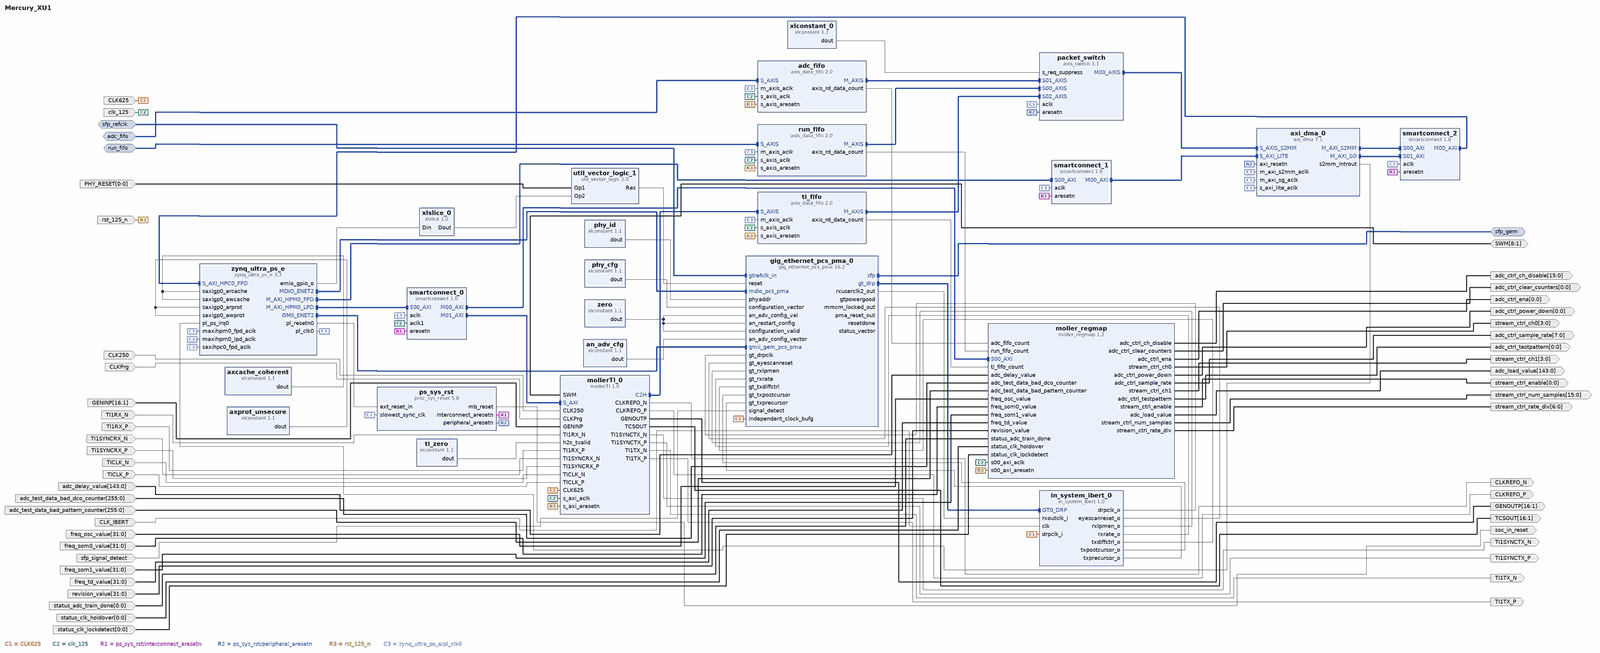
[diagram p0: block diagram of the top level, whole]
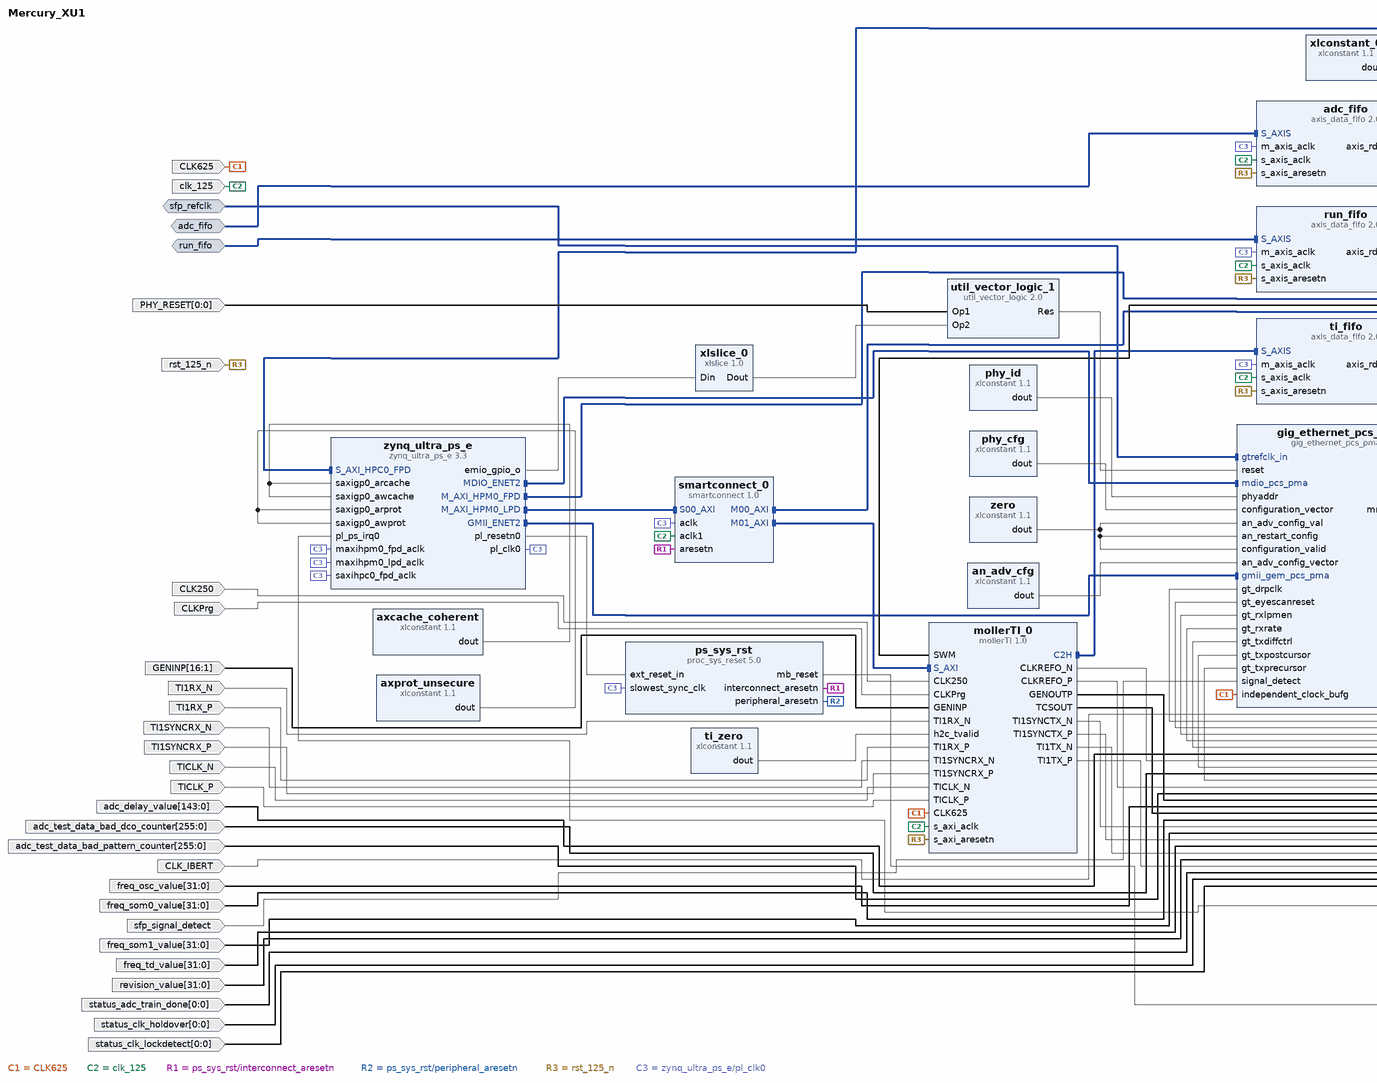
[diagram p1: block diagram of the top level, left part]
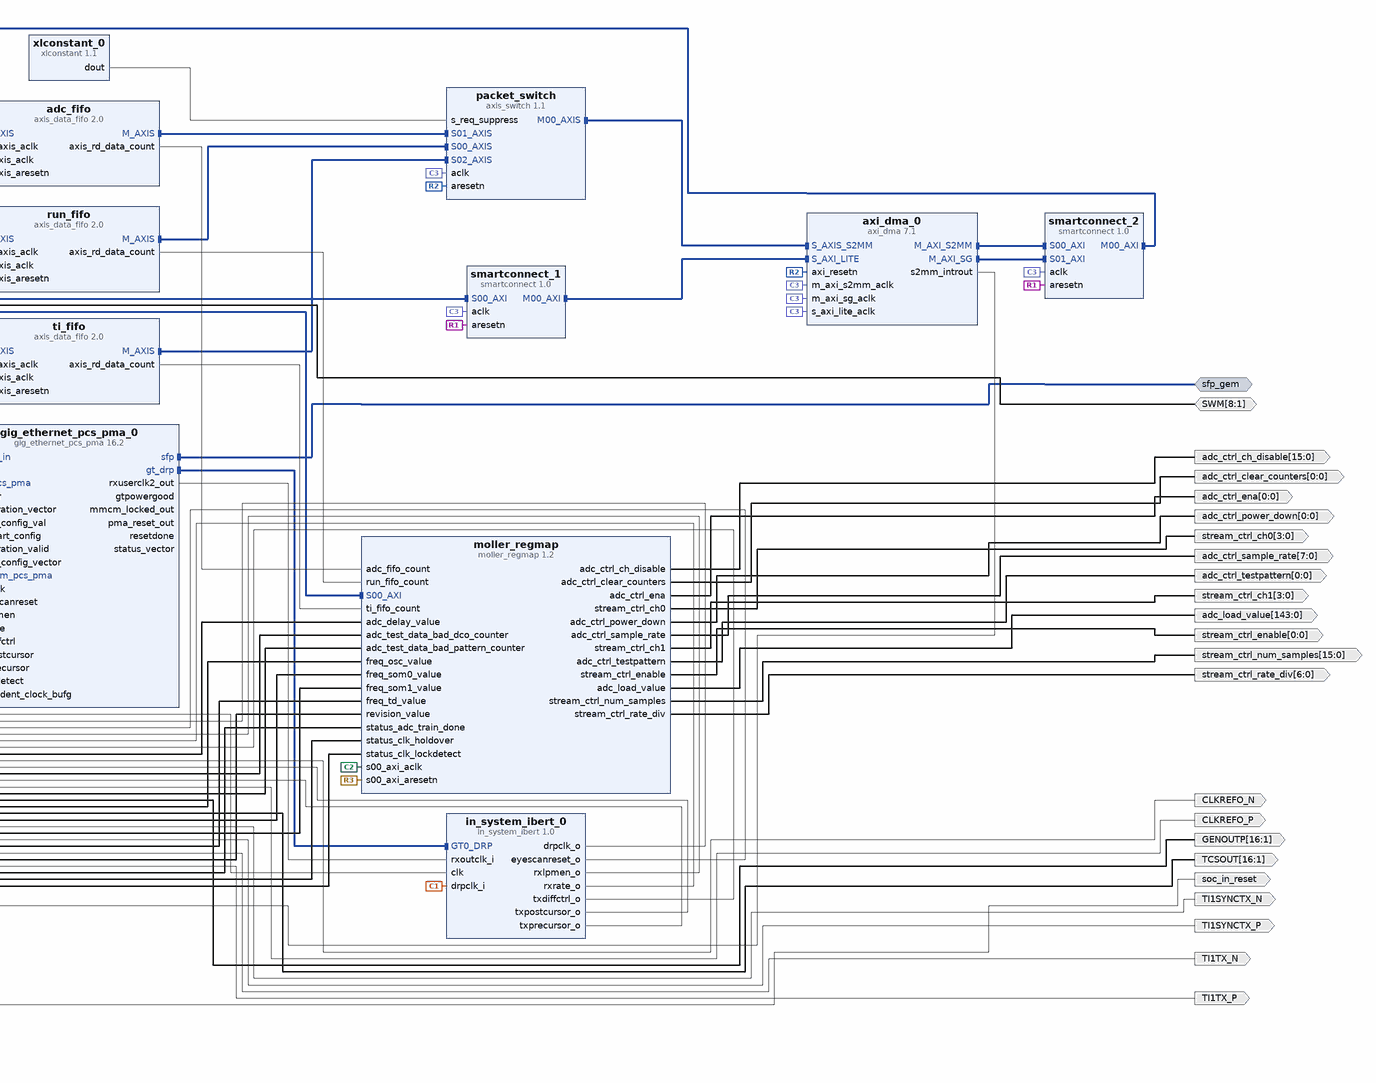
[diagram p2: block diagram of the top level, right part]
# Vivado block design Mercury_XU1, xczu6cg-ffvc900-1-e, Vivado 2020.2
create_bd_design Mercury_XU1

create_bd_intf_port -mode Slave -vlnv xilinx.com:interface:axis_rtl:1.0 adc_fifo
set_property -dict [list \
  CONFIG.FREQ_HZ 125000000 \
  CONFIG.HAS_TKEEP 0 \
  CONFIG.HAS_TLAST 1 \
  CONFIG.HAS_TREADY 1 \
  CONFIG.HAS_TSTRB 0 \
  CONFIG.LAYERED_METADATA undef \
  CONFIG.TDATA_NUM_BYTES 8 \
  CONFIG.TDEST_WIDTH 0 \
  CONFIG.TID_WIDTH 0 \
  CONFIG.TUSER_WIDTH 0 \
] [get_bd_intf_ports adc_fifo]
create_bd_intf_port -mode Slave -vlnv xilinx.com:interface:axis_rtl:1.0 run_fifo
set_property -dict [list \
  CONFIG.FREQ_HZ 125000000 \
  CONFIG.HAS_TKEEP 0 \
  CONFIG.HAS_TLAST 1 \
  CONFIG.HAS_TREADY 1 \
  CONFIG.HAS_TSTRB 0 \
  CONFIG.LAYERED_METADATA undef \
  CONFIG.TDATA_NUM_BYTES 8 \
  CONFIG.TDEST_WIDTH 0 \
  CONFIG.TID_WIDTH 0 \
  CONFIG.TUSER_WIDTH 0 \
] [get_bd_intf_ports run_fifo]
create_bd_intf_port -mode Slave -vlnv xilinx.com:interface:diff_clock_rtl:1.0 sfp_refclk
set_property -dict {CONFIG.FREQ_HZ 125000000} [get_bd_intf_ports sfp_refclk]
create_bd_intf_port -mode Master -vlnv xilinx.com:interface:sfp_rtl:1.0 sfp_gem
create_bd_port -dir I CLK250
create_bd_port -dir I CLK625
create_bd_port -dir I CLKPrg
create_bd_port -dir O CLKREFO_N
create_bd_port -dir O CLKREFO_P
create_bd_port -dir I -type clk CLK_IBERT
set_property -dict {CONFIG.FREQ_HZ 100000000} [get_bd_ports CLK_IBERT]
create_bd_port -dir I -from 16 -to 1 GENINP
create_bd_port -dir O -from 16 -to 1 GENOUTP
create_bd_port -dir I -from 0 -to 0 PHY_RESET
create_bd_port -dir IO -from 8 -to 1 SWM
create_bd_port -dir O -from 16 -to 1 TCSOUT
create_bd_port -dir I TI1RX_N
create_bd_port -dir I TI1RX_P
create_bd_port -dir I TI1SYNCRX_N
create_bd_port -dir I TI1SYNCRX_P
create_bd_port -dir O TI1SYNCTX_N
create_bd_port -dir O TI1SYNCTX_P
create_bd_port -dir O TI1TX_N
create_bd_port -dir O TI1TX_P
create_bd_port -dir I TICLK_N
create_bd_port -dir I TICLK_P
create_bd_port -dir O -from 15 -to 0 adc_ctrl_ch_disable
create_bd_port -dir O -from 0 -to 0 adc_ctrl_clear_counters
create_bd_port -dir O -from 0 -to 0 adc_ctrl_ena
create_bd_port -dir O -from 0 -to 0 adc_ctrl_power_down
create_bd_port -dir O -from 7 -to 0 adc_ctrl_sample_rate
create_bd_port -dir O -from 0 -to 0 adc_ctrl_testpattern
create_bd_port -dir I -from 143 -to 0 adc_delay_value
create_bd_port -dir O -from 143 -to 0 adc_load_value
create_bd_port -dir I -from 255 -to 0 adc_test_data_bad_dco_counter
create_bd_port -dir I -from 255 -to 0 adc_test_data_bad_pattern_counter
create_bd_port -dir I -type clk clk_125
set_property -dict [list \
  CONFIG.ASSOCIATED_BUSIF run_fifo:adc_fifo \
  CONFIG.ASSOCIATED_RESET rst_125_n:soc_in_reset:SYNC_RESET_0 \
  CONFIG.FREQ_HZ 125000000 \
] [get_bd_ports clk_125]
create_bd_port -dir I -from 31 -to 0 freq_osc_value
create_bd_port -dir I -from 31 -to 0 freq_som0_value
create_bd_port -dir I -from 31 -to 0 freq_som1_value
create_bd_port -dir I -from 31 -to 0 freq_td_value
create_bd_port -dir I -from 31 -to 0 revision_value
create_bd_port -dir I -type rst rst_125_n
set_property -dict {CONFIG.POLARITY ACTIVE_LOW} [get_bd_ports rst_125_n]
create_bd_port -dir I sfp_signal_detect
create_bd_port -dir O -type rst soc_in_reset
create_bd_port -dir I -from 0 -to 0 status_adc_train_done
create_bd_port -dir I -from 0 -to 0 status_clk_holdover
create_bd_port -dir I -from 0 -to 0 status_clk_lockdetect
create_bd_port -dir O -from 3 -to 0 stream_ctrl_ch0
create_bd_port -dir O -from 3 -to 0 stream_ctrl_ch1
create_bd_port -dir O -from 0 -to 0 stream_ctrl_enable
create_bd_port -dir O -from 15 -to 0 stream_ctrl_num_samples
create_bd_port -dir O -from 6 -to 0 stream_ctrl_rate_div

create_bd_cell -type ip -vlnv xilinx.com:ip:axis_data_fifo:2.0 adc_fifo
set_property -dict [list \
  CONFIG.FIFO_DEPTH 8192 \
  CONFIG.FIFO_MODE 2 \
  CONFIG.HAS_PROG_FULL 0 \
  CONFIG.HAS_RD_DATA_COUNT 1 \
  CONFIG.HAS_WR_DATA_COUNT 0 \
  CONFIG.IS_ACLK_ASYNC 1 \
  CONFIG.TDATA_NUM_BYTES 8 \
] [get_bd_cells adc_fifo]
create_bd_cell -type ip -vlnv xilinx.com:ip:xlconstant:1.1 an_adv_cfg
set_property -dict {CONFIG.CONST_VAL 32 CONFIG.CONST_WIDTH 16} [get_bd_cells an_adv_cfg]
create_bd_cell -type ip -vlnv xilinx.com:ip:xlconstant:1.1 axcache_coherent
set_property -dict {CONFIG.CONST_VAL 11 CONFIG.CONST_WIDTH 4} [get_bd_cells axcache_coherent]
create_bd_cell -type ip -vlnv xilinx.com:ip:axi_dma:7.1 axi_dma_0
set_property -dict [list \
  CONFIG.c_addr_width 48 \
  CONFIG.c_enable_multi_channel 0 \
  CONFIG.c_include_mm2s 0 \
  CONFIG.c_include_s2mm_dre 0 \
  CONFIG.c_s2mm_burst_size 256 \
  CONFIG.c_sg_include_stscntrl_strm 0 \
  CONFIG.c_sg_length_width 26 \
] [get_bd_cells axi_dma_0]
create_bd_cell -type ip -vlnv xilinx.com:ip:xlconstant:1.1 axprot_unsecure
set_property -dict {CONFIG.CONST_VAL 2 CONFIG.CONST_WIDTH 3} [get_bd_cells axprot_unsecure]
create_bd_cell -type ip -vlnv xilinx.com:ip:gig_ethernet_pcs_pma:16.2 gig_ethernet_pcs_pma_0
set_property -dict [list \
  CONFIG.Auto_Negotiation true \
  CONFIG.DrpClkRate 62.5 \
  CONFIG.EMAC_IF_TEMAC GEM \
  CONFIG.Ext_Management_Interface false \
  CONFIG.GT_Location X1Y4 \
  CONFIG.GTinEx false \
  CONFIG.RefClkRate 156.25 \
  CONFIG.RxGmiiClkSrc TXOUTCLK \
  CONFIG.SGMII_PHY_Mode true \
  CONFIG.Standard 1000BASEX \
  CONFIG.SupportLevel Include_Shared_Logic_in_Core \
  CONFIG.TransceiverControl true \
] [get_bd_cells gig_ethernet_pcs_pma_0]
create_bd_cell -type ip -vlnv xilinx.com:ip:in_system_ibert:1.0 in_system_ibert_0
set_property -dict {CONFIG.C_ENABLE_INPUT_PORTS true CONFIG.C_GTS_USED { X1Y4}} [get_bd_cells in_system_ibert_0]
create_bd_cell -type ip -vlnv TRIUMF:user:moller_regmap:1.2 moller_regmap
create_bd_cell -type ip -vlnv xilinx.com:ip:axis_switch:1.1 packet_switch
set_property -dict [list \
  CONFIG.ARB_ALGORITHM 0 \
  CONFIG.ARB_ON_MAX_XFERS 0 \
  CONFIG.ARB_ON_NUM_CYCLES 0 \
  CONFIG.ARB_ON_TLAST 1 \
  CONFIG.HAS_TLAST 1 \
  CONFIG.NUM_SI 3 \
  CONFIG.ROUTING_MODE 0 \
  CONFIG.TDATA_NUM_BYTES 8 \
] [get_bd_cells packet_switch]
create_bd_cell -type ip -vlnv xilinx.com:ip:xlconstant:1.1 phy_cfg
set_property -dict {CONFIG.CONST_VAL 0x0 CONFIG.CONST_WIDTH 5} [get_bd_cells phy_cfg]
create_bd_cell -type ip -vlnv xilinx.com:ip:xlconstant:1.1 phy_id
set_property -dict {CONFIG.CONST_VAL 9 CONFIG.CONST_WIDTH 5} [get_bd_cells phy_id]
create_bd_cell -type ip -vlnv xilinx.com:ip:proc_sys_reset:5.0 ps_sys_rst
create_bd_cell -type ip -vlnv xilinx.com:ip:axis_data_fifo:2.0 run_fifo
set_property -dict [list \
  CONFIG.FIFO_DEPTH 1024 \
  CONFIG.FIFO_MODE 2 \
  CONFIG.HAS_RD_DATA_COUNT 1 \
  CONFIG.HAS_WR_DATA_COUNT 0 \
  CONFIG.IS_ACLK_ASYNC 1 \
  CONFIG.TDATA_NUM_BYTES 8 \
] [get_bd_cells run_fifo]
create_bd_cell -type ip -vlnv xilinx.com:ip:smartconnect:1.0 smartconnect_0
set_property -dict {CONFIG.NUM_CLKS 2 CONFIG.NUM_MI 2 CONFIG.NUM_SI 1} [get_bd_cells smartconnect_0]
create_bd_cell -type ip -vlnv xilinx.com:ip:smartconnect:1.0 smartconnect_1
set_property -dict {CONFIG.NUM_SI 1} [get_bd_cells smartconnect_1]
create_bd_cell -type ip -vlnv xilinx.com:ip:smartconnect:1.0 smartconnect_2
set_property -dict {CONFIG.NUM_MI 1 CONFIG.NUM_SI 2} [get_bd_cells smartconnect_2]
create_bd_cell -type ip -vlnv xilinx.com:ip:axis_data_fifo:2.0 ti_fifo
set_property -dict [list \
  CONFIG.FIFO_DEPTH 256 \
  CONFIG.FIFO_MODE 2 \
  CONFIG.HAS_RD_DATA_COUNT 1 \
  CONFIG.HAS_WR_DATA_COUNT 0 \
  CONFIG.IS_ACLK_ASYNC 1 \
  CONFIG.TDATA_NUM_BYTES 8 \
] [get_bd_cells ti_fifo]
create_bd_cell -type ip -vlnv xilinx.com:ip:xlconstant:1.1 ti_zero
set_property -dict {CONFIG.CONST_VAL 0} [get_bd_cells ti_zero]
create_bd_cell -type ip -vlnv xilinx.com:ip:util_vector_logic:2.0 util_vector_logic_1
set_property -dict {CONFIG.C_OPERATION or CONFIG.C_SIZE 1} [get_bd_cells util_vector_logic_1]
create_bd_cell -type ip -vlnv xilinx.com:ip:xlconstant:1.1 xlconstant_0
set_property -dict {CONFIG.CONST_VAL 0 CONFIG.CONST_WIDTH 3} [get_bd_cells xlconstant_0]
create_bd_cell -type ip -vlnv xilinx.com:ip:xlslice:1.0 xlslice_0
set_property -dict {CONFIG.DIN_WIDTH 32} [get_bd_cells xlslice_0]
create_bd_cell -type ip -vlnv xilinx.com:ip:xlconstant:1.1 zero
set_property -dict {CONFIG.CONST_VAL 0 CONFIG.CONST_WIDTH 1} [get_bd_cells zero]
create_bd_cell -type ip -vlnv xilinx.com:ip:zynq_ultra_ps_e:3.3 zynq_ultra_ps_e
set_property -dict [list \
  CONFIG.CAN0_BOARD_INTERFACE custom \
  CONFIG.CAN1_BOARD_INTERFACE custom \
  CONFIG.CSU_BOARD_INTERFACE custom \
  CONFIG.DP_BOARD_INTERFACE custom \
  CONFIG.GEM0_BOARD_INTERFACE custom \
  CONFIG.GEM1_BOARD_INTERFACE custom \
  CONFIG.GEM2_BOARD_INTERFACE custom \
  CONFIG.GEM3_BOARD_INTERFACE custom \
  CONFIG.GPIO_BOARD_INTERFACE custom \
  CONFIG.IIC0_BOARD_INTERFACE custom \
  CONFIG.IIC1_BOARD_INTERFACE custom \
  CONFIG.NAND_BOARD_INTERFACE custom \
  CONFIG.PCIE_BOARD_INTERFACE custom \
  CONFIG.PJTAG_BOARD_INTERFACE custom \
  CONFIG.PMU_BOARD_INTERFACE custom \
  CONFIG.PSU_BANK_0_IO_STANDARD LVCMOS18 \
  CONFIG.PSU_BANK_1_IO_STANDARD LVCMOS18 \
  CONFIG.PSU_BANK_2_IO_STANDARD LVCMOS18 \
  CONFIG.PSU_BANK_3_IO_STANDARD LVCMOS18 \
  CONFIG.PSU_USB3__DUAL_CLOCK_ENABLE 1 \
  CONFIG.PSU__ACPU2__POWER__ON 0 \
  CONFIG.PSU__ACPU3__POWER__ON 0 \
  CONFIG.PSU__CAN1__PERIPHERAL__ENABLE 0 \
  CONFIG.PSU__CRF_APB__ACPU_CTRL__FREQMHZ 1200 \
  CONFIG.PSU__CRF_APB__ACPU_CTRL__SRCSEL APLL \
  CONFIG.PSU__CRF_APB__APLL_CTRL__SRCSEL PSS_REF_CLK \
  CONFIG.PSU__CRF_APB__DBG_FPD_CTRL__FREQMHZ 250 \
  CONFIG.PSU__CRF_APB__DBG_FPD_CTRL__SRCSEL IOPLL \
  CONFIG.PSU__CRF_APB__DBG_TRACE_CTRL__FREQMHZ 250 \
  CONFIG.PSU__CRF_APB__DBG_TRACE_CTRL__SRCSEL IOPLL \
  CONFIG.PSU__CRF_APB__DBG_TSTMP_CTRL__FREQMHZ 250 \
  CONFIG.PSU__CRF_APB__DBG_TSTMP_CTRL__SRCSEL IOPLL \
  CONFIG.PSU__CRF_APB__DDR_CTRL__FREQMHZ 1200 \
  CONFIG.PSU__CRF_APB__DDR_CTRL__SRCSEL DPLL \
  CONFIG.PSU__CRF_APB__DPDMA_REF_CTRL__FREQMHZ 600 \
  CONFIG.PSU__CRF_APB__DPDMA_REF_CTRL__SRCSEL DPLL \
  CONFIG.PSU__CRF_APB__DPLL_CTRL__SRCSEL PSS_REF_CLK \
  CONFIG.PSU__CRF_APB__DP_AUDIO_REF_CTRL__SRCSEL VPLL \
  CONFIG.PSU__CRF_APB__DP_STC_REF_CTRL__SRCSEL VPLL \
  CONFIG.PSU__CRF_APB__DP_VIDEO_REF_CTRL__SRCSEL DPLL \
  CONFIG.PSU__CRF_APB__GDMA_REF_CTRL__FREQMHZ 600 \
  CONFIG.PSU__CRF_APB__GDMA_REF_CTRL__SRCSEL DPLL \
  CONFIG.PSU__CRF_APB__GPU_REF_CTRL__FREQMHZ 600 \
  CONFIG.PSU__CRF_APB__GPU_REF_CTRL__SRCSEL DPLL \
  CONFIG.PSU__CRF_APB__TOPSW_LSBUS_CTRL__FREQMHZ 100 \
  CONFIG.PSU__CRF_APB__TOPSW_LSBUS_CTRL__SRCSEL IOPLL \
  CONFIG.PSU__CRF_APB__TOPSW_MAIN_CTRL__FREQMHZ 533.333 \
  CONFIG.PSU__CRF_APB__TOPSW_MAIN_CTRL__SRCSEL VPLL \
  CONFIG.PSU__CRF_APB__VPLL_CTRL__SRCSEL PSS_REF_CLK \
  CONFIG.PSU__CRL_APB__ADMA_REF_CTRL__FREQMHZ 500 \
  CONFIG.PSU__CRL_APB__ADMA_REF_CTRL__SRCSEL IOPLL \
  CONFIG.PSU__CRL_APB__CAN1_REF_CTRL__FREQMHZ 100 \
  CONFIG.PSU__CRL_APB__CAN1_REF_CTRL__SRCSEL IOPLL \
  CONFIG.PSU__CRL_APB__CPU_R5_CTRL__FREQMHZ 500 \
  CONFIG.PSU__CRL_APB__CPU_R5_CTRL__SRCSEL IOPLL \
  CONFIG.PSU__CRL_APB__DBG_LPD_CTRL__FREQMHZ 250 \
  CONFIG.PSU__CRL_APB__DBG_LPD_CTRL__SRCSEL IOPLL \
  CONFIG.PSU__CRL_APB__GEM3_REF_CTRL__FREQMHZ 125 \
  CONFIG.PSU__CRL_APB__GEM3_REF_CTRL__SRCSEL IOPLL \
  CONFIG.PSU__CRL_APB__I2C0_REF_CTRL__FREQMHZ 100 \
  CONFIG.PSU__CRL_APB__I2C0_REF_CTRL__SRCSEL IOPLL \
  CONFIG.PSU__CRL_APB__I2C1_REF_CTRL__FREQMHZ 100 \
  CONFIG.PSU__CRL_APB__I2C1_REF_CTRL__SRCSEL IOPLL \
  CONFIG.PSU__CRL_APB__IOPLL_CTRL__SRCSEL PSS_REF_CLK \
  CONFIG.PSU__CRL_APB__IOU_SWITCH_CTRL__FREQMHZ 267 \
  CONFIG.PSU__CRL_APB__IOU_SWITCH_CTRL__SRCSEL RPLL \
  CONFIG.PSU__CRL_APB__LPD_LSBUS_CTRL__FREQMHZ 100 \
  CONFIG.PSU__CRL_APB__LPD_LSBUS_CTRL__SRCSEL IOPLL \
  CONFIG.PSU__CRL_APB__LPD_SWITCH_CTRL__FREQMHZ 500 \
  CONFIG.PSU__CRL_APB__LPD_SWITCH_CTRL__SRCSEL IOPLL \
  CONFIG.PSU__CRL_APB__PCAP_CTRL__FREQMHZ 200 \
  CONFIG.PSU__CRL_APB__PCAP_CTRL__SRCSEL IOPLL \
  CONFIG.PSU__CRL_APB__PL0_REF_CTRL__FREQMHZ 125 \
  CONFIG.PSU__CRL_APB__PL0_REF_CTRL__SRCSEL IOPLL \
  CONFIG.PSU__CRL_APB__PL1_REF_CTRL__FREQMHZ 50 \
  CONFIG.PSU__CRL_APB__PL1_REF_CTRL__SRCSEL IOPLL \
  CONFIG.PSU__CRL_APB__QSPI_REF_CTRL__FREQMHZ 200 \
  CONFIG.PSU__CRL_APB__QSPI_REF_CTRL__SRCSEL RPLL \
  CONFIG.PSU__CRL_APB__RPLL_CTRL__SRCSEL PSS_REF_CLK \
  CONFIG.PSU__CRL_APB__SDIO1_REF_CTRL__FREQMHZ 200 \
  CONFIG.PSU__CRL_APB__SDIO1_REF_CTRL__SRCSEL RPLL \
  CONFIG.PSU__CRL_APB__TIMESTAMP_REF_CTRL__FREQMHZ 100 \
  CONFIG.PSU__CRL_APB__TIMESTAMP_REF_CTRL__SRCSEL PSS_REF_CLK \
  CONFIG.PSU__CRL_APB__UART0_REF_CTRL__FREQMHZ 100 \
  CONFIG.PSU__CRL_APB__UART0_REF_CTRL__SRCSEL IOPLL \
  CONFIG.PSU__CRL_APB__UART1_REF_CTRL__FREQMHZ 100 \
  CONFIG.PSU__CRL_APB__UART1_REF_CTRL__SRCSEL IOPLL \
  CONFIG.PSU__CRL_APB__USB0_BUS_REF_CTRL__FREQMHZ 250 \
  CONFIG.PSU__CRL_APB__USB0_BUS_REF_CTRL__SRCSEL IOPLL \
  CONFIG.PSU__CRL_APB__USB3_DUAL_REF_CTRL__FREQMHZ 20 \
  CONFIG.PSU__CRL_APB__USB3_DUAL_REF_CTRL__SRCSEL IOPLL \
  CONFIG.PSU__CRL_APB__USB3__ENABLE 0 \
  CONFIG.PSU__CSUPMU__PERIPHERAL__VALID 0 \
  CONFIG.PSU__DDRC__BUS_WIDTH {64 Bit} \
  CONFIG.PSU__DDRC__COMPONENTS Components \
  CONFIG.PSU__DDRC__DEVICE_CAPACITY {4096 MBits} \
  CONFIG.PSU__DDRC__DRAM_WIDTH {16 Bits} \
  CONFIG.PSU__DDRC__ECC Enabled \
  CONFIG.PSU__DDRC__MEMORY_TYPE {DDR 4} \
  CONFIG.PSU__DDRC__SPEED_BIN DDR4_2400T \
  CONFIG.PSU__DDR_HIGH_ADDRESS_GUI_ENABLE 0 \
  CONFIG.PSU__DDR__INTERFACE__FREQMHZ 600.000 \
  CONFIG.PSU__DEVICE_TYPE CG \
  CONFIG.PSU__DISPLAYPORT__PERIPHERAL__ENABLE 0 \
  CONFIG.PSU__DLL__ISUSED 1 \
  CONFIG.PSU__ENET0__GRP_MDIO__ENABLE 1 \
  CONFIG.PSU__ENET0__GRP_MDIO__IO {MIO 76 .. 77} \
  CONFIG.PSU__ENET0__PERIPHERAL__ENABLE 1 \
  CONFIG.PSU__ENET0__PERIPHERAL__IO {MIO 26 .. 37} \
  CONFIG.PSU__ENET2__GRP_MDIO__ENABLE 1 \
  CONFIG.PSU__ENET2__GRP_MDIO__IO EMIO \
  CONFIG.PSU__ENET2__PERIPHERAL__ENABLE 1 \
  CONFIG.PSU__ENET2__PERIPHERAL__IO EMIO \
  CONFIG.PSU__ENET3__FIFO__ENABLE 0 \
  CONFIG.PSU__ENET3__GRP_MDIO__ENABLE 0 \
  CONFIG.PSU__ENET3__PERIPHERAL__ENABLE 1 \
  CONFIG.PSU__ENET3__PERIPHERAL__IO {MIO 64 .. 75} \
  CONFIG.PSU__ENET3__PTP__ENABLE 0 \
  CONFIG.PSU__ENET3__TSU__ENABLE 0 \
  CONFIG.PSU__FPD_SLCR__WDT1__FREQMHZ 100 \
  CONFIG.PSU__FPGA_PL0_ENABLE 1 \
  CONFIG.PSU__FPGA_PL1_ENABLE 1 \
  CONFIG.PSU__GEM3_COHERENCY 0 \
  CONFIG.PSU__GEM3_ROUTE_THROUGH_FPD 0 \
  CONFIG.PSU__GEM__TSU__ENABLE 0 \
  CONFIG.PSU__GPIO0_MIO__PERIPHERAL__ENABLE 0 \
  CONFIG.PSU__GPIO1_MIO__IO {MIO 26 .. 51} \
  CONFIG.PSU__GPIO1_MIO__PERIPHERAL__ENABLE 1 \
  CONFIG.PSU__GPIO_EMIO_WIDTH 32 \
  CONFIG.PSU__GPIO_EMIO__PERIPHERAL__ENABLE 1 \
  CONFIG.PSU__GPIO_EMIO__PERIPHERAL__IO 32 \
  CONFIG.PSU__GPU_PP0__POWER__ON 0 \
  CONFIG.PSU__GPU_PP1__POWER__ON 0 \
  CONFIG.PSU__I2C0__PERIPHERAL__ENABLE 1 \
  CONFIG.PSU__I2C0__PERIPHERAL__IO {MIO 10 .. 11} \
  CONFIG.PSU__I2C1__PERIPHERAL__ENABLE 0 \
  CONFIG.PSU__IOU_SLCR__IOU_TTC_APB_CLK__TTC0_SEL APB \
  CONFIG.PSU__IOU_SLCR__IOU_TTC_APB_CLK__TTC1_SEL APB \
  CONFIG.PSU__IOU_SLCR__IOU_TTC_APB_CLK__TTC2_SEL APB \
  CONFIG.PSU__IOU_SLCR__IOU_TTC_APB_CLK__TTC3_SEL APB \
  CONFIG.PSU__IOU_SLCR__TTC1__FREQMHZ 100 \
  CONFIG.PSU__IOU_SLCR__TTC2__FREQMHZ 100 \
  CONFIG.PSU__IOU_SLCR__TTC3__FREQMHZ 100 \
  CONFIG.PSU__IOU_SLCR__WDT0__FREQMHZ 100 \
  CONFIG.PSU__LPD_SLCR__CSUPMU__FREQMHZ 100 \
  CONFIG.PSU__MAXIGP0__DATA_WIDTH 32 \
  CONFIG.PSU__OVERRIDE_HPX_QOS 0 \
  CONFIG.PSU__OVERRIDE__BASIC_CLOCK 0 \
  CONFIG.PSU__PMU__PERIPHERAL__ENABLE 0 \
  CONFIG.PSU__PRESET_APPLIED 0 \
  CONFIG.PSU__PSS_REF_CLK__FREQMHZ 33.333 \
  CONFIG.PSU__QSPI_COHERENCY 0 \
  CONFIG.PSU__QSPI_ROUTE_THROUGH_FPD 0 \
  CONFIG.PSU__QSPI__GRP_FBCLK__ENABLE 1 \
  CONFIG.PSU__QSPI__GRP_FBCLK__IO {MIO 6} \
  CONFIG.PSU__QSPI__PERIPHERAL__DATA_MODE x4 \
  CONFIG.PSU__QSPI__PERIPHERAL__ENABLE 1 \
  CONFIG.PSU__QSPI__PERIPHERAL__IO {MIO 0 .. 5} \
  CONFIG.PSU__QSPI__PERIPHERAL__MODE Single \
  CONFIG.PSU__SATA__PERIPHERAL__ENABLE 0 \
  CONFIG.PSU__SAXIGP0__DATA_WIDTH 64 \
  CONFIG.PSU__SD0__DATA_TRANSFER_MODE 8Bit \
  CONFIG.PSU__SD0__PERIPHERAL__ENABLE 1 \
  CONFIG.PSU__SD0__PERIPHERAL__IO {MIO 13 .. 22} \
  CONFIG.PSU__SD0__SLOT_TYPE eMMC \
  CONFIG.PSU__SD1_COHERENCY 0 \
  CONFIG.PSU__SD1_ROUTE_THROUGH_FPD 0 \
  CONFIG.PSU__SD1__DATA_TRANSFER_MODE 4Bit \
  CONFIG.PSU__SD1__GRP_CD__ENABLE 0 \
  CONFIG.PSU__SD1__GRP_POW__ENABLE 0 \
  CONFIG.PSU__SD1__GRP_WP__ENABLE 0 \
  CONFIG.PSU__SD1__PERIPHERAL__ENABLE 1 \
  CONFIG.PSU__SD1__PERIPHERAL__IO {MIO 46 .. 51} \
  CONFIG.PSU__SD1__SLOT_TYPE {SD 2.0} \
  CONFIG.PSU__SWDT0__PERIPHERAL__ENABLE 0 \
  CONFIG.PSU__SWDT1__PERIPHERAL__ENABLE 0 \
  CONFIG.PSU__TSU__BUFG_PORT_PAIR 0 \
  CONFIG.PSU__TTC0__CLOCK__ENABLE 0 \
  CONFIG.PSU__TTC0__PERIPHERAL__ENABLE 1 \
  CONFIG.PSU__TTC0__WAVEOUT__ENABLE 0 \
  CONFIG.PSU__TTC1__PERIPHERAL__ENABLE 0 \
  CONFIG.PSU__TTC2__PERIPHERAL__ENABLE 0 \
  CONFIG.PSU__TTC3__PERIPHERAL__ENABLE 0 \
  CONFIG.PSU__UART0__BAUD_RATE 115200 \
  CONFIG.PSU__UART0__MODEM__ENABLE 0 \
  CONFIG.PSU__UART0__PERIPHERAL__ENABLE 1 \
  CONFIG.PSU__UART0__PERIPHERAL__IO {MIO 38 .. 39} \
  CONFIG.PSU__UART1__PERIPHERAL__ENABLE 0 \
  CONFIG.PSU__USB0_COHERENCY 0 \
  CONFIG.PSU__USB0__PERIPHERAL__ENABLE 1 \
  CONFIG.PSU__USB0__PERIPHERAL__IO {MIO 52 .. 63} \
  CONFIG.PSU__USB2_0__EMIO__ENABLE 0 \
  CONFIG.PSU__USB3_0__PERIPHERAL__ENABLE 0 \
  CONFIG.PSU__USB__RESET__MODE Disable \
  CONFIG.PSU__USE__IRQ0 1 \
  CONFIG.PSU__USE__M_AXI_GP0 1 \
  CONFIG.PSU__USE__M_AXI_GP1 0 \
  CONFIG.PSU__USE__M_AXI_GP2 1 \
  CONFIG.PSU__USE__S_AXI_GP0 1 \
  CONFIG.QSPI_BOARD_INTERFACE custom \
  CONFIG.SATA_BOARD_INTERFACE custom \
  CONFIG.SD0_BOARD_INTERFACE custom \
  CONFIG.SD1_BOARD_INTERFACE custom \
  CONFIG.SPI0_BOARD_INTERFACE custom \
  CONFIG.SPI1_BOARD_INTERFACE custom \
  CONFIG.SUBPRESET1 Custom \
  CONFIG.SUBPRESET2 Custom \
  CONFIG.SWDT0_BOARD_INTERFACE custom \
  CONFIG.SWDT1_BOARD_INTERFACE custom \
  CONFIG.TRACE_BOARD_INTERFACE custom \
  CONFIG.TTC0_BOARD_INTERFACE custom \
  CONFIG.TTC1_BOARD_INTERFACE custom \
  CONFIG.TTC2_BOARD_INTERFACE custom \
  CONFIG.TTC3_BOARD_INTERFACE custom \
  CONFIG.UART0_BOARD_INTERFACE custom \
  CONFIG.UART1_BOARD_INTERFACE custom \
  CONFIG.USB0_BOARD_INTERFACE custom \
  CONFIG.USB1_BOARD_INTERFACE custom \
  CONFIG.preset None \
] [get_bd_cells zynq_ultra_ps_e]
# 723 more settings of zynq_ultra_ps_e are not shown: defaults, MIO pin electricals, DDR timing, and values the tool derives
create_bd_cell -type ip -vlnv user.org:user:mollerTI:1.0 mollerTI_0

# ---- connections ----

connect_bd_intf_net -intf_net priority_switch_M00_AXIS [get_bd_intf_pins axi_dma_0/S_AXIS_S2MM] [get_bd_intf_pins packet_switch/M00_AXIS]
connect_bd_intf_net [get_bd_intf_pins packet_switch/S02_AXIS] [get_bd_intf_pins ti_fifo/M_AXIS]
connect_bd_intf_net -intf_net sfp_data_refclk_1 [get_bd_intf_ports sfp_refclk] [get_bd_intf_pins gig_ethernet_pcs_pma_0/gtrefclk_in]
connect_bd_intf_net [get_bd_intf_pins mollerTI_0/C2H] [get_bd_intf_pins ti_fifo/S_AXIS]
connect_bd_intf_net [get_bd_intf_pins moller_regmap/S00_AXI] [get_bd_intf_pins smartconnect_0/M00_AXI]
connect_bd_intf_net [get_bd_intf_pins gig_ethernet_pcs_pma_0/mdio_pcs_pma] [get_bd_intf_pins zynq_ultra_ps_e/MDIO_ENET2]
connect_bd_intf_net -intf_net S_AXIS_0_1 [get_bd_intf_ports run_fifo] [get_bd_intf_pins run_fifo/S_AXIS]
connect_bd_intf_net [get_bd_intf_pins smartconnect_0/S00_AXI] [get_bd_intf_pins zynq_ultra_ps_e/M_AXI_HPM0_LPD]
connect_bd_intf_net -intf_net S_AXIS_1_1 [get_bd_intf_ports adc_fifo] [get_bd_intf_pins adc_fifo/S_AXIS]
connect_bd_intf_net [get_bd_intf_pins smartconnect_2/M00_AXI] [get_bd_intf_pins zynq_ultra_ps_e/S_AXI_HPC0_FPD]
connect_bd_intf_net [get_bd_intf_ports sfp_gem] [get_bd_intf_pins gig_ethernet_pcs_pma_0/sfp]
connect_bd_intf_net [get_bd_intf_pins smartconnect_1/S00_AXI] [get_bd_intf_pins zynq_ultra_ps_e/M_AXI_HPM0_FPD]
connect_bd_intf_net -intf_net zynq_ultra_ps_e_GMII_ENET1 [get_bd_intf_pins gig_ethernet_pcs_pma_0/gmii_gem_pcs_pma] [get_bd_intf_pins zynq_ultra_ps_e/GMII_ENET2]
connect_bd_intf_net [get_bd_intf_pins axi_dma_0/S_AXI_LITE] [get_bd_intf_pins smartconnect_1/M00_AXI]
connect_bd_intf_net [get_bd_intf_pins gig_ethernet_pcs_pma_0/gt_drp] [get_bd_intf_pins in_system_ibert_0/GT0_DRP]
connect_bd_intf_net [get_bd_intf_pins axi_dma_0/M_AXI_S2MM] [get_bd_intf_pins smartconnect_2/S00_AXI]
connect_bd_intf_net [get_bd_intf_pins adc_fifo/M_AXIS] [get_bd_intf_pins packet_switch/S01_AXIS]
connect_bd_intf_net [get_bd_intf_pins mollerTI_0/S_AXI] [get_bd_intf_pins smartconnect_0/M01_AXI]
connect_bd_intf_net [get_bd_intf_pins axi_dma_0/M_AXI_SG] [get_bd_intf_pins smartconnect_2/S01_AXI]
connect_bd_intf_net [get_bd_intf_pins packet_switch/S00_AXIS] [get_bd_intf_pins run_fifo/M_AXIS]
connect_bd_net -net CLK250_1 [get_bd_ports CLK250] [get_bd_pins mollerTI_0/CLK250]
connect_bd_net -net CLK625_1 [get_bd_ports CLK625] \
  [get_bd_pins gig_ethernet_pcs_pma_0/independent_clock_bufg] [get_bd_pins in_system_ibert_0/drpclk_i] \
  [get_bd_pins mollerTI_0/CLK625]
connect_bd_net [get_bd_ports CLKPrg] [get_bd_pins mollerTI_0/CLKPrg]
connect_bd_net [get_bd_ports GENINP] [get_bd_pins mollerTI_0/GENINP]
connect_bd_net [get_bd_ports clk_125] \
  [get_bd_pins adc_fifo/s_axis_aclk] [get_bd_pins moller_regmap/s00_axi_aclk] [get_bd_pins run_fifo/s_axis_aclk] \
  [get_bd_pins smartconnect_0/aclk1] [get_bd_pins ti_fifo/s_axis_aclk] [get_bd_pins mollerTI_0/s_axi_aclk]
connect_bd_net [get_bd_ports SWM] [get_bd_pins mollerTI_0/SWM]
connect_bd_net [get_bd_ports PHY_RESET] [get_bd_pins util_vector_logic_1/Op1]
connect_bd_net [get_bd_ports TI1RX_N] [get_bd_pins mollerTI_0/TI1RX_N]
connect_bd_net [get_bd_ports TI1RX_P] [get_bd_pins mollerTI_0/TI1RX_P]
connect_bd_net [get_bd_ports TI1SYNCRX_N] [get_bd_pins mollerTI_0/TI1SYNCRX_N]
connect_bd_net [get_bd_ports TI1SYNCRX_P] [get_bd_pins mollerTI_0/TI1SYNCRX_P]
connect_bd_net [get_bd_ports TICLK_N] [get_bd_pins mollerTI_0/TICLK_N]
connect_bd_net [get_bd_ports TICLK_P] [get_bd_pins mollerTI_0/TICLK_P]
connect_bd_net -net adc_delay_value_0_1 [get_bd_ports adc_delay_value] [get_bd_pins moller_regmap/adc_delay_value]
connect_bd_net [get_bd_pins adc_fifo/axis_rd_data_count] [get_bd_pins moller_regmap/adc_fifo_count]
connect_bd_net [get_bd_ports adc_test_data_bad_dco_counter] [get_bd_pins moller_regmap/adc_test_data_bad_dco_counter]
connect_bd_net [get_bd_ports adc_test_data_bad_pattern_counter] [get_bd_pins moller_regmap/adc_test_data_bad_pattern_counter]
connect_bd_net [get_bd_pins axcache_coherent/dout] [get_bd_pins zynq_ultra_ps_e/saxigp0_arcache] [get_bd_pins zynq_ultra_ps_e/saxigp0_awcache]
connect_bd_net [get_bd_pins axi_dma_0/s2mm_introut] [get_bd_pins zynq_ultra_ps_e/pl_ps_irq0]
connect_bd_net [get_bd_pins axprot_unsecure/dout] [get_bd_pins zynq_ultra_ps_e/saxigp0_arprot] [get_bd_pins zynq_ultra_ps_e/saxigp0_awprot]
connect_bd_net -net clk_0_1 [get_bd_ports CLK_IBERT] [get_bd_pins in_system_ibert_0/clk]
connect_bd_net -net freq_osc_value_0_1 [get_bd_ports freq_osc_value] [get_bd_pins moller_regmap/freq_osc_value]
connect_bd_net -net freq_som0_value_0_1 [get_bd_ports freq_som0_value] [get_bd_pins moller_regmap/freq_som0_value]
connect_bd_net -net freq_som1_value_0_1 [get_bd_ports freq_som1_value] [get_bd_pins moller_regmap/freq_som1_value]
connect_bd_net -net freq_td_value_0_1 [get_bd_ports freq_td_value] [get_bd_pins moller_regmap/freq_td_value]
connect_bd_net [get_bd_pins gig_ethernet_pcs_pma_0/rxuserclk2_out] [get_bd_pins in_system_ibert_0/rxoutclk_i]
# net gtpowergood has one end: gig_ethernet_pcs_pma_0/gtpowergood
connect_bd_net [get_bd_pins in_system_ibert_0/drpclk_o] [get_bd_pins gig_ethernet_pcs_pma_0/gt_drpclk]
connect_bd_net [get_bd_pins in_system_ibert_0/eyescanreset_o] [get_bd_pins gig_ethernet_pcs_pma_0/gt_eyescanreset]
connect_bd_net [get_bd_pins in_system_ibert_0/rxlpmen_o] [get_bd_pins gig_ethernet_pcs_pma_0/gt_rxlpmen]
connect_bd_net [get_bd_pins in_system_ibert_0/rxrate_o] [get_bd_pins gig_ethernet_pcs_pma_0/gt_rxrate]
connect_bd_net [get_bd_pins in_system_ibert_0/txdiffctrl_o] [get_bd_pins gig_ethernet_pcs_pma_0/gt_txdiffctrl]
connect_bd_net [get_bd_pins in_system_ibert_0/txpostcursor_o] [get_bd_pins gig_ethernet_pcs_pma_0/gt_txpostcursor]
connect_bd_net [get_bd_pins in_system_ibert_0/txprecursor_o] [get_bd_pins gig_ethernet_pcs_pma_0/gt_txprecursor]
# net mmcm_locked_out has one end: gig_ethernet_pcs_pma_0/mmcm_locked_out
connect_bd_net [get_bd_pins mollerTI_0/CLKREFO_N] [get_bd_ports CLKREFO_N]
connect_bd_net [get_bd_pins mollerTI_0/CLKREFO_P] [get_bd_ports CLKREFO_P]
connect_bd_net [get_bd_pins mollerTI_0/GENOUTP] [get_bd_ports GENOUTP]
connect_bd_net [get_bd_pins mollerTI_0/TCSOUT] [get_bd_ports TCSOUT]
connect_bd_net [get_bd_pins mollerTI_0/TI1SYNCTX_N] [get_bd_ports TI1SYNCTX_N]
connect_bd_net [get_bd_pins mollerTI_0/TI1SYNCTX_P] [get_bd_ports TI1SYNCTX_P]
connect_bd_net [get_bd_pins mollerTI_0/TI1TX_N] [get_bd_ports TI1TX_N]
connect_bd_net [get_bd_pins mollerTI_0/TI1TX_P] [get_bd_ports TI1TX_P]
connect_bd_net -net moller_regmap_0_stream_ctrl_ch0 [get_bd_pins moller_regmap/stream_ctrl_ch0] [get_bd_ports stream_ctrl_ch0]
connect_bd_net -net moller_regmap_0_stream_ctrl_ch1 [get_bd_pins moller_regmap/stream_ctrl_ch1] [get_bd_ports stream_ctrl_ch1]
connect_bd_net -net moller_regmap_0_stream_ctrl_enable [get_bd_pins moller_regmap/stream_ctrl_enable] [get_bd_ports stream_ctrl_enable]
connect_bd_net -net moller_regmap_0_stream_ctrl_num_samples [get_bd_pins moller_regmap/stream_ctrl_num_samples] [get_bd_ports stream_ctrl_num_samples]
connect_bd_net -net moller_regmap_0_stream_ctrl_rate_div [get_bd_pins moller_regmap/stream_ctrl_rate_div] [get_bd_ports stream_ctrl_rate_div]
connect_bd_net [get_bd_pins moller_regmap/adc_ctrl_ch_disable] [get_bd_ports adc_ctrl_ch_disable]
connect_bd_net [get_bd_pins moller_regmap/adc_ctrl_clear_counters] [get_bd_ports adc_ctrl_clear_counters]
connect_bd_net [get_bd_pins moller_regmap/adc_ctrl_ena] [get_bd_ports adc_ctrl_ena]
connect_bd_net [get_bd_pins moller_regmap/adc_ctrl_power_down] [get_bd_ports adc_ctrl_power_down]
connect_bd_net [get_bd_pins moller_regmap/adc_ctrl_sample_rate] [get_bd_ports adc_ctrl_sample_rate]
connect_bd_net [get_bd_pins moller_regmap/adc_ctrl_testpattern] [get_bd_ports adc_ctrl_testpattern]
connect_bd_net [get_bd_pins moller_regmap/adc_load_value] [get_bd_ports adc_load_value]
# net pma_reset_out has one end: gig_ethernet_pcs_pma_0/pma_reset_out
connect_bd_net [get_bd_pins ps_sys_rst/interconnect_aresetn] \
  [get_bd_pins smartconnect_0/aresetn] [get_bd_pins smartconnect_1/aresetn] [get_bd_pins smartconnect_2/aresetn]
connect_bd_net [get_bd_pins ps_sys_rst/mb_reset] [get_bd_ports soc_in_reset]
connect_bd_net [get_bd_pins ps_sys_rst/peripheral_aresetn] [get_bd_pins axi_dma_0/axi_resetn] [get_bd_pins packet_switch/aresetn]
# net resetdone has one end: gig_ethernet_pcs_pma_0/resetdone
connect_bd_net [get_bd_ports revision_value] [get_bd_pins moller_regmap/revision_value]
connect_bd_net -net rst_125_1 [get_bd_ports rst_125_n] \
  [get_bd_pins adc_fifo/s_axis_aresetn] [get_bd_pins moller_regmap/s00_axi_aresetn] [get_bd_pins run_fifo/s_axis_aresetn] \
  [get_bd_pins ti_fifo/s_axis_aresetn] [get_bd_pins mollerTI_0/s_axi_aresetn]
connect_bd_net [get_bd_pins run_fifo/axis_rd_data_count] [get_bd_pins moller_regmap/run_fifo_count]
connect_bd_net -net signal_detect_0_1 [get_bd_ports sfp_signal_detect] [get_bd_pins gig_ethernet_pcs_pma_0/signal_detect]
connect_bd_net -net status_adc_train_done_0_1 [get_bd_ports status_adc_train_done] [get_bd_pins moller_regmap/status_adc_train_done]
connect_bd_net -net status_clk_holdover_0_1 [get_bd_ports status_clk_holdover] [get_bd_pins moller_regmap/status_clk_holdover]
connect_bd_net -net status_clk_lockdetect_0_1 [get_bd_ports status_clk_lockdetect] [get_bd_pins moller_regmap/status_clk_lockdetect]
# net status_vector has one end: gig_ethernet_pcs_pma_0/status_vector
connect_bd_net [get_bd_pins ti_fifo/axis_rd_data_count] [get_bd_pins moller_regmap/ti_fifo_count]
connect_bd_net [get_bd_pins util_vector_logic_1/Res] [get_bd_pins gig_ethernet_pcs_pma_0/reset]
connect_bd_net [get_bd_pins xlconstant_0/dout] [get_bd_pins packet_switch/s_req_suppress]
connect_bd_net -net xlconstant_4_dout [get_bd_pins ti_zero/dout] [get_bd_pins mollerTI_0/h2c_tvalid]
connect_bd_net -net xlconstant_6_dout [get_bd_pins phy_id/dout] [get_bd_pins gig_ethernet_pcs_pma_0/phyaddr]
connect_bd_net -net xlconstant_7_dout [get_bd_pins phy_cfg/dout] [get_bd_pins gig_ethernet_pcs_pma_0/configuration_vector]
connect_bd_net -net xlconstant_8_dout [get_bd_pins zero/dout] \
  [get_bd_pins gig_ethernet_pcs_pma_0/an_adv_config_val] [get_bd_pins gig_ethernet_pcs_pma_0/an_restart_config] \
  [get_bd_pins gig_ethernet_pcs_pma_0/configuration_valid]
connect_bd_net -net xlconstant_9_dout [get_bd_pins an_adv_cfg/dout] [get_bd_pins gig_ethernet_pcs_pma_0/an_adv_config_vector]
connect_bd_net [get_bd_pins xlslice_0/Dout] [get_bd_pins util_vector_logic_1/Op2]
connect_bd_net -net zynq_ultra_ps_e_emio_gpio_o [get_bd_pins zynq_ultra_ps_e/emio_gpio_o] [get_bd_pins xlslice_0/Din]
connect_bd_net [get_bd_pins zynq_ultra_ps_e/pl_clk0] \
  [get_bd_pins adc_fifo/m_axis_aclk] [get_bd_pins axi_dma_0/m_axi_s2mm_aclk] [get_bd_pins axi_dma_0/m_axi_sg_aclk] \
  [get_bd_pins axi_dma_0/s_axi_lite_aclk] [get_bd_pins packet_switch/aclk] [get_bd_pins ps_sys_rst/slowest_sync_clk] \
  [get_bd_pins run_fifo/m_axis_aclk] [get_bd_pins smartconnect_0/aclk] [get_bd_pins smartconnect_1/aclk] \
  [get_bd_pins smartconnect_2/aclk] [get_bd_pins ti_fifo/m_axis_aclk] [get_bd_pins zynq_ultra_ps_e/maxihpm0_fpd_aclk] \
  [get_bd_pins zynq_ultra_ps_e/maxihpm0_lpd_aclk] [get_bd_pins zynq_ultra_ps_e/saxihpc0_fpd_aclk]
connect_bd_net [get_bd_pins zynq_ultra_ps_e/pl_resetn0] [get_bd_pins ps_sys_rst/ext_reset_in]
set_property HDL_ATTRIBUTE.DEBUG true [get_bd_intf_nets zynq_ultra_ps_e_GMII_ENET1]
set_property HDL_ATTRIBUTE.MARK_DEBUG true [get_bd_intf_nets zynq_ultra_ps_e_GMII_ENET1]
set_property HDL_ATTRIBUTE.DEBUG true [get_bd_nets gtpowergood]
set_property HDL_ATTRIBUTE.MARK_DEBUG true [get_bd_nets gtpowergood]
set_property HDL_ATTRIBUTE.DEBUG true [get_bd_nets mmcm_locked_out]
set_property HDL_ATTRIBUTE.MARK_DEBUG true [get_bd_nets mmcm_locked_out]
set_property HDL_ATTRIBUTE.DEBUG true [get_bd_nets pma_reset_out]
set_property HDL_ATTRIBUTE.MARK_DEBUG true [get_bd_nets pma_reset_out]
set_property HDL_ATTRIBUTE.DEBUG true [get_bd_nets resetdone]
set_property HDL_ATTRIBUTE.MARK_DEBUG true [get_bd_nets resetdone]
set_property HDL_ATTRIBUTE.DEBUG true [get_bd_nets status_vector]
set_property HDL_ATTRIBUTE.MARK_DEBUG true [get_bd_nets status_vector]
set_property HDL_ATTRIBUTE.DEBUG true [get_bd_nets zynq_ultra_ps_e_emio_gpio_o]
set_property HDL_ATTRIBUTE.MARK_DEBUG true [get_bd_nets zynq_ultra_ps_e_emio_gpio_o]

# ---- address map ----
assign_bd_address -offset 0x000000000000 -range 2G -target_address_space [get_bd_addr_spaces axi_dma_0/Data_S2MM] [get_bd_addr_segs zynq_ultra_ps_e/SAXIGP0/HPC0_DDR_LOW]
assign_bd_address -offset 0x0000C0000000 -range 512M -target_address_space [get_bd_addr_spaces axi_dma_0/Data_S2MM] [get_bd_addr_segs zynq_ultra_ps_e/SAXIGP0/HPC0_QSPI]
exclude_bd_addr_seg -offset 0x0000FF000000 -range 16M -target_address_space [get_bd_addr_spaces axi_dma_0/Data_S2MM] [get_bd_addr_segs zynq_ultra_ps_e/SAXIGP0/HPC0_LPS_OCM]
assign_bd_address -offset 0x000000000000 -range 2G -target_address_space [get_bd_addr_spaces axi_dma_0/Data_SG] [get_bd_addr_segs zynq_ultra_ps_e/SAXIGP0/HPC0_DDR_LOW]
assign_bd_address -offset 0x0000C0000000 -range 512M -target_address_space [get_bd_addr_spaces axi_dma_0/Data_SG] [get_bd_addr_segs zynq_ultra_ps_e/SAXIGP0/HPC0_QSPI]
exclude_bd_addr_seg -offset 0x0000FF000000 -range 16M -target_address_space [get_bd_addr_spaces axi_dma_0/Data_SG] [get_bd_addr_segs zynq_ultra_ps_e/SAXIGP0/HPC0_LPS_OCM]
assign_bd_address -offset 0x0080000000 -range 64K -target_address_space [get_bd_addr_spaces zynq_ultra_ps_e/Data] [get_bd_addr_segs moller_regmap/S00_AXI/S00_AXI_reg]
assign_bd_address -offset 0x0080010000 -range 64K -target_address_space [get_bd_addr_spaces zynq_ultra_ps_e/Data] [get_bd_addr_segs mollerTI_0/S_AXI/S_AXI_reg]
assign_bd_address -offset 0x00A0000000 -range 64K -target_address_space [get_bd_addr_spaces zynq_ultra_ps_e/Data] [get_bd_addr_segs axi_dma_0/S_AXI_LITE/Reg]

validate_bd_design
save_bd_design
